# EAGLE design PCB_NEW_Tx (EAGLE 9.6.2)
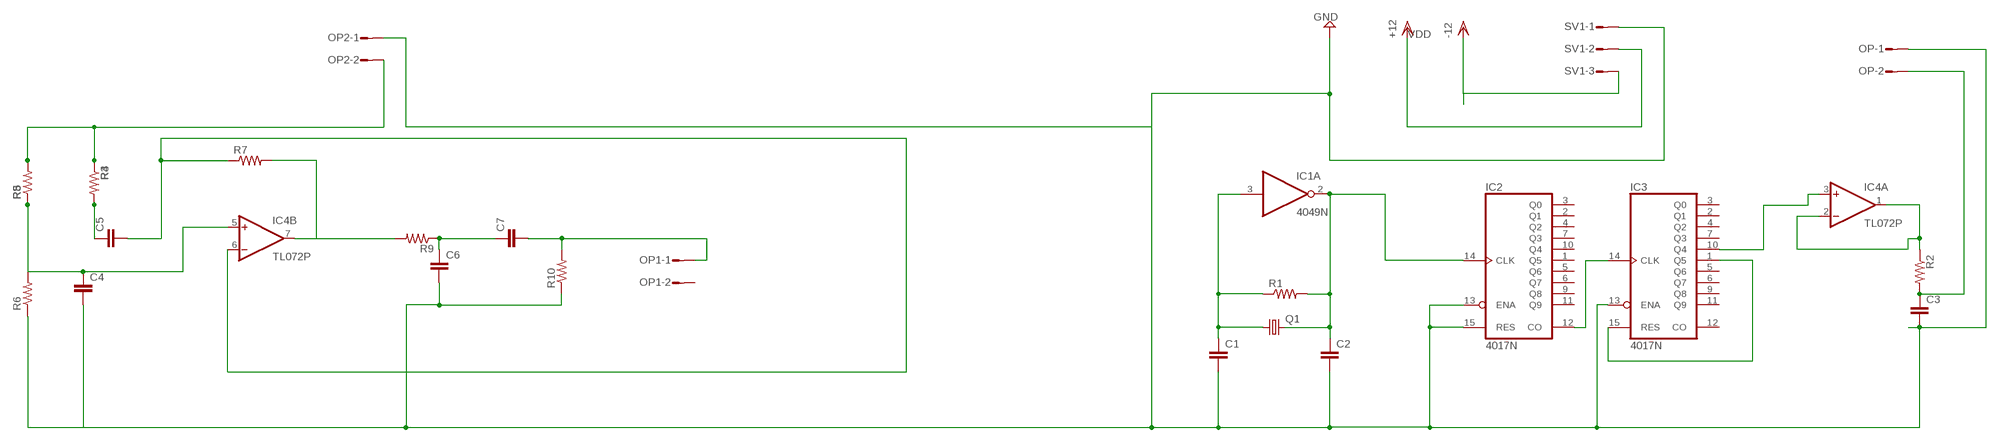
[diagram p0: schematic, sheet 1]

## Parts
C1  C5/3.5  [C5B3.5]
C2  C5/3.5  [C5B3.5]
C3  C5/3.5  [C5B3.5]
C4  C5/3.5  [C5B3.5]
C5  C5/3.5  [C5B3.5]
C6  C5/3.5  [C5B3.5]
C7  C5/3.5  [C5B3.5]
IC1  4049N  [DIL16]
IC2  4017N  [DIL16]
IC3  4017N  [DIL16]
IC4  TL072P  [DIL08]
OP  L02P  [L02P]
OP1  L02P  [L02P]
OP2  L02P  [L02P]
Q1  CRYSTALHC33U-V  [HC33U-V]
R1  R-US_0207/12  [0207/12]
R2  R-US_0207/12  [0207/12]
R3  R-US_0204/7  [0204/7]
R4  R-US_0204/7  [0204/7]
R5  R-US_0204/7  [0204/7]
R6  R-US_0204/7  [0204/7]
R7  R-US_0204/7  [0204/7]
R8  R-US_0204/7  [0204/7]
R9  R-US_0204/7  [0204/7]
R10  R-US_0204/7  [0204/7]
SV1  L03P  [L03P]

## Nets
GND: C1.2 C2.2 C3.2 C4.2 C6.2 IC2.13(ENA) IC2.15(RES) IC3.13(ENA) OP2.1 OP.1 R6.1 R10.1 SV1.1
N$1: C1.1 IC1.3(A:I) Q1.1 R1.1
N$2: C2.1 IC1.2(A:O) IC2.14(CLK) Q1.2 R1.2
N$3: C3.1 OP.2 R2.2
N$4: IC3.1(Q5) IC3.15(RES)
N$5: IC3.10(Q4) IC4.3(A:+IN)
N$6: IC4.1(A:OUT) IC4.2(A:-IN) R2.1
N$7: C4.1 IC4.5(B:+IN) R5.1 R6.2 R8.1
N$8: IC2.12(CO) IC3.14(CLK)
N$9: C5.1 R3.2 R4.2
N$10: OP2.2 R3.1 R4.1 R5.2 R8.2
N$11: C5.2 IC4.6(B:-IN) R7.1
N$12: C7.2 OP1.1 R10.2
N$13: IC4.7(B:OUT) R7.2 R9.2
N$14: C6.1 C7.1 R9.1
VDD: SV1.2 SV1.3 ; supply symbol labelled -12, +12
Unconnected: IC1.4(B:O) IC1.5(B:I) IC1.6(C:O) IC1.7(C:I) IC1.9(D:I) IC1.10(D:O) IC1.11(E:I) IC1.12(E:O) IC1.14(F:I) IC1.15(F:O) IC2.1(Q5) IC2.2(Q1) IC2.3(Q0) IC2.4(Q2) IC2.5(Q6) IC2.6(Q7) IC2.7(Q3) IC2.9(Q8) IC2.10(Q4) IC2.11(Q9) IC3.2(Q1) IC3.3(Q0) IC3.4(Q2) IC3.5(Q6) IC3.6(Q7) IC3.7(Q3) IC3.9(Q8) IC3.11(Q9) IC3.12(CO) OP1.2

## Power pins joined to a net without a drawn wire
V+: IC4.8(P:V+)
V-: IC4.4(P:V-)
VDD: IC1.1(P:VDD) IC2.16(VDD) IC3.16(VDD)
VSS: IC1.8(P:VSS) IC2.8(VSS) IC3.8(VSS)

## Library data of the parts
C1-C7 = capacitor-wima:C: CAPACITOR naming: grid - package width
IC1 = 40xx:4049: Hex inverting BUFFER
IC2 IC3 = 40xx:4017: COUNTER/DIVIDER
IC4 = linear:TL072: OP AMP
OP OP1 OP2 = con-amp-mt:L02P: AMP MT CONNECTOR; OC_FARNELL: unknown; OC_NEWARK: unknown
Q1 = crystal:CRYSTAL: CRYSTAL; OC_FARNELL: unknown; OC_NEWARK: unknown
R1-R10 = rcl:R-US_: RESISTOR, American symbol; SPICEPREFIX: R
SV1 = con-amp-mt:L03P: AMP MT CONNECTOR; OC_FARNELL: unknown; OC_NEWARK: unknown

## Board
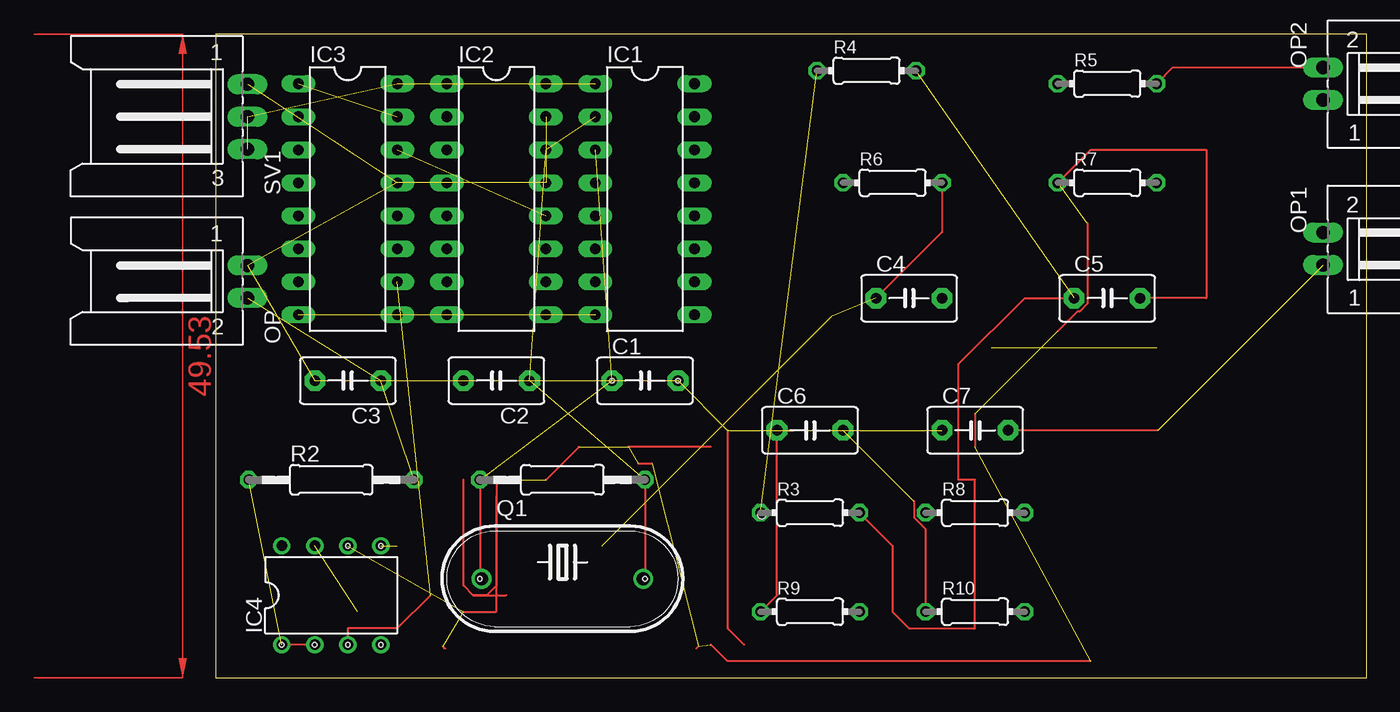
[diagram p1: board, top side]
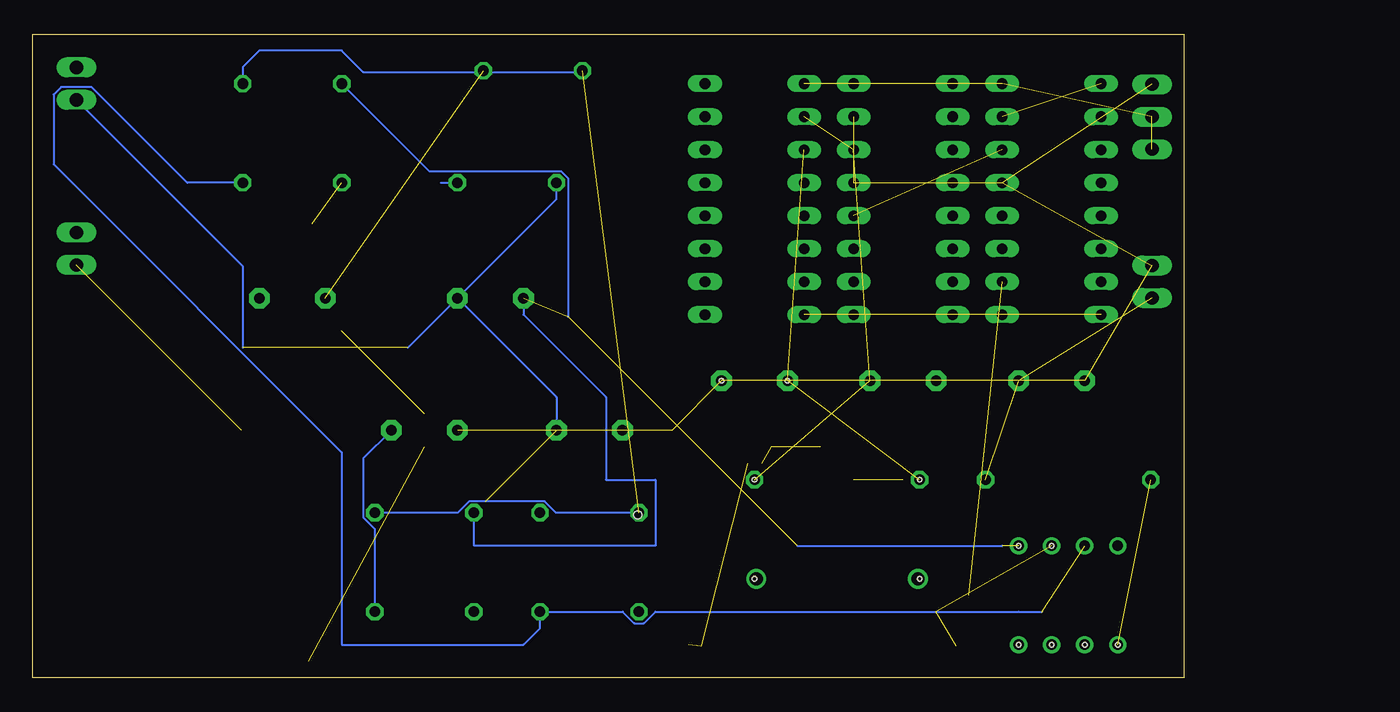
[diagram p2: board, bottom side, seen from below]

Size 88.57 x 49.52 mm. Coordinates in mm from the lower left corner, seen from the top.
Outline: 0,0 88.57,0 88.57,49.52 0,49.52 0,0
Copper layers (1*16): Top 0.035mm / dielectric 1.5mm / Bottom 0.035mm
Design rules "default *": minimum track width 6mil, minimum drill 0.6mm, track to track 6mil, track to pad 6mil, pad to pad 6mil, via to via 6mil, smd to smd 6mil, copper to edge 40mil, drill to drill 6mil, minimum pad ring 10mil, minimum via ring 8mil, stop-mask expansion 4mil, vias tented up to drill 0mil, thermal gap 10mil
Holes 0.35 mm at 20.32,7.62 33.02,7.62 33.02,15.24 20.32,15.24 12.7,2.54 10.16,2.54 7.62,2.54 5.08,2.54 10.16,10.16 12.7,10.16 30.48,22.86 35.56,22.86
Holes 0.6 mm at 42,12.52

### Footprints (pad centres in the part's own frame; a part is rotated, then mirrored left to right if it is on the bottom)
C5B3.5 = drill 0.813 pad 1.6 octagon: 1 -2.54,0; 2 2.54,0
DIL16 = drill 0.813 long: 1 -8.89,-3.81; 2 -6.35,-3.81; 3 -3.81,-3.81; 4 -1.27,-3.81; 5 1.27,-3.81; 6 3.81,-3.81; 7 6.35,-3.81; 8 8.89,-3.81; 9 8.89,3.81; 10 6.35,3.81; 11 3.81,3.81; 12 1.27,3.81; 13 -1.27,3.81; 14 -3.81,3.81; 15 -6.35,3.81; 16 -8.89,3.81
DIL08 = drill 0.813 pad 1.27: 1 -3.81,-3.81; 2 -1.27,-3.81; 3 1.27,-3.81; 4 3.81,-3.81; 5 3.81,3.81; 6 1.27,3.81; 7 -1.27,3.81; 8 -3.81,3.81
L02P = drill 1.016 long: 1 1.25,-6.25; 2 -1.25,-6.25
HC33U-V = drill 1.016: 1 -6.223,0; 2 6.223,0
0207/12 = drill 0.813 octagon: 1 -6.35,0; 2 6.35,0
0204/7 = drill 0.813 octagon: 1 -3.81,0; 2 3.81,0
L03P = drill 1.016 long: 1 2.5,-6.25; 2 0,-6.25; 3 -2.5,-6.25

### Placement (x,y rotation side)
C1  33.02,22.86 0 top
C2  21.59,22.86 180 top
C3  10.16,22.86 180 top
C4  53.34,29.21 0 top
C5  68.58,29.21 0 top
C6  45.72,19.05 0 top
C7  58.42,19.05 0 top
IC1  33.02,36.83 270 top
IC2  21.59,36.83 270 top
IC3  10.16,36.83 270 top
IC4  8.89,6.35 0 top
OP  -3.81,30.48 90 top
OP1  91.44,33.02 270 top
OP2  91.44,45.72 270 top
Q1  26.67,7.62 0 top
R1  26.67,15.24 0 top
R2  8.89,15.24 0 top
R3  45.72,12.7 0 top
R4  50.07,46.72 0 top
R5  68.58,45.72 0 top
R6  52.07,38.1 0 top
R7  68.58,38.1 0 top
R8  58.42,12.7 0 top
R9  45.72,5.08 0 top
R10  58.42,5.08 0 top
SV1  -3.81,43.18 90 top

### Tracks (layer width: path | path; a pad name or v marks a point on that pad's centre or on a via)
GND  (11 unrouted)
  Top 0.152: R10.1 54.61,11.44 53.72,12.33 53.72,13.59 | 40.64,2.54 39.37,3.81 39.37,19.05
  Bottom 0.152: OP2.1 72.39,31.67 72.39,25.4 | 59.69,25.4 C4.2 | C4.2 48.26,36.83 R6.1 | C4.2 48.26,21.59 C6.2
N$1  (2 unrouted)
  Top 0.152: R1.1 20.32,7.75 Q1.1
N$2  (3 unrouted)
  Top 0.152: R1.2 33.02,7.75 Q1.2
N$3  (2 unrouted)
N$4  (1 unrouted)
N$5  (1 unrouted)
  Top 0.152: 16.51,6.35 13.97,3.81 10.16,3.81 IC4.3
N$6  (1 unrouted)
  Top 0.152: IC4.2 IC4.1
N$7  (3 unrouted)
  Top 0.152: R6.2 55.88,34.29 C4.1
  Bottom 0.152: 47.37,27.8 47.37,38.47 47.89,38.99 58.04,38.99 R5.1 | 29.73,10.16 13.97,10.16 | 57.15,38.1 R6.2 | C4.1 50.8,27.94 44.45,21.59 44.45,15.24 40.64,15.24 40.64,10.16 54.61,10.16 R8.1
N$8  (1 unrouted)
N$9  (1 unrouted)
  Top 0.152: R3.2 52.07,10.16 52.07,5.08 53.34,3.81 58.42,3.81 58.42,15.24 57.15,15.24 57.15,24.13 62.23,29.21 C5.1
N$10  (1 unrouted)
  Top 0.152: R5.2 73.64,46.97 OP2.2
  Bottom 0.152: R4.1 46.37,46.61 63.12,46.61 64.77,48.26 71.12,48.26 72.39,46.99 R5.2 | R3.1 48.27,12.7 49.16,13.59 54.98,13.59 55.87,12.7 R8.2
N$11  (10 unrouted)
  Top 0.152: R7.1 67.31,40.64 76.2,40.64 76.2,29.21 C5.2 | 67.07,34.96 67.07,28.78 66.47,28.18 66.28,28.18 64.77,26.67 | 58.42,20.32 58.42,17.78 | 67.31,1.27 39.37,1.27 38.1,2.54 | 38.1,17.78 31.75,17.78 | 27.94,17.78 25.4,15.24 | 21.59,15.24 21.59,13.97 | 21.59,13.97 21.59,5.08 19.05,5.08 | 19.05,15.24 | 19.8,6.35 19.05,7.1 | 20.84,6.35 19.8,6.35 | 21.59,7.1 20.84,6.35 | 19.05,7.1 19.05,15.24 | 21.59,13.97 21.59,7.1 | 21.59,13.97 | 21.59,7.1 20.84,6.35 | 20.84,6.35 19.8,6.35 | 19.8,6.35 19.05,7.1 | 21.59,13.97 | 21.59,13.97 21.59,7.1 | 19.05,7.1 19.05,15.24 | 32.49,16.51 33.55,16.51 | 37.13,2.41 36.96,2.24 | 17.65,2.24 17.48,2.41 | 19.05,7.1 19.8,6.35 | 19.8,6.35 22.34,6.35
N$12  (1 unrouted)
  Top 0.152: 72.47,19.05 C7.2
  Bottom 0.152: R10.2 62.23,11.44 63.12,12.33 63.12,16.89 C7.2
N$13  (1 unrouted)
  Bottom 0.152: R7.2 76.66,38.1 84.02,45.46 86.36,45.46 86.94,44.88 86.94,39.52 64.77,17.35 64.77,2.54 50.8,2.54 49.53,3.81 R9.2 43.17,5.08 42.28,4.19 41.54,4.19 40.65,5.08 12.7,5.08 10.91,5.08
N$14  (1 unrouted)
  Top 0.152: R9.1 43.18,6.35 C6.1 44.45,19.05
VDD  (4 unrouted)
VSS  (2 unrouted)
(copper drawn outside any net)
  shapes: Top area x2